# EAGLE design BreaV6 (EAGLE 8.4.3)

## Sheet 1 of 2
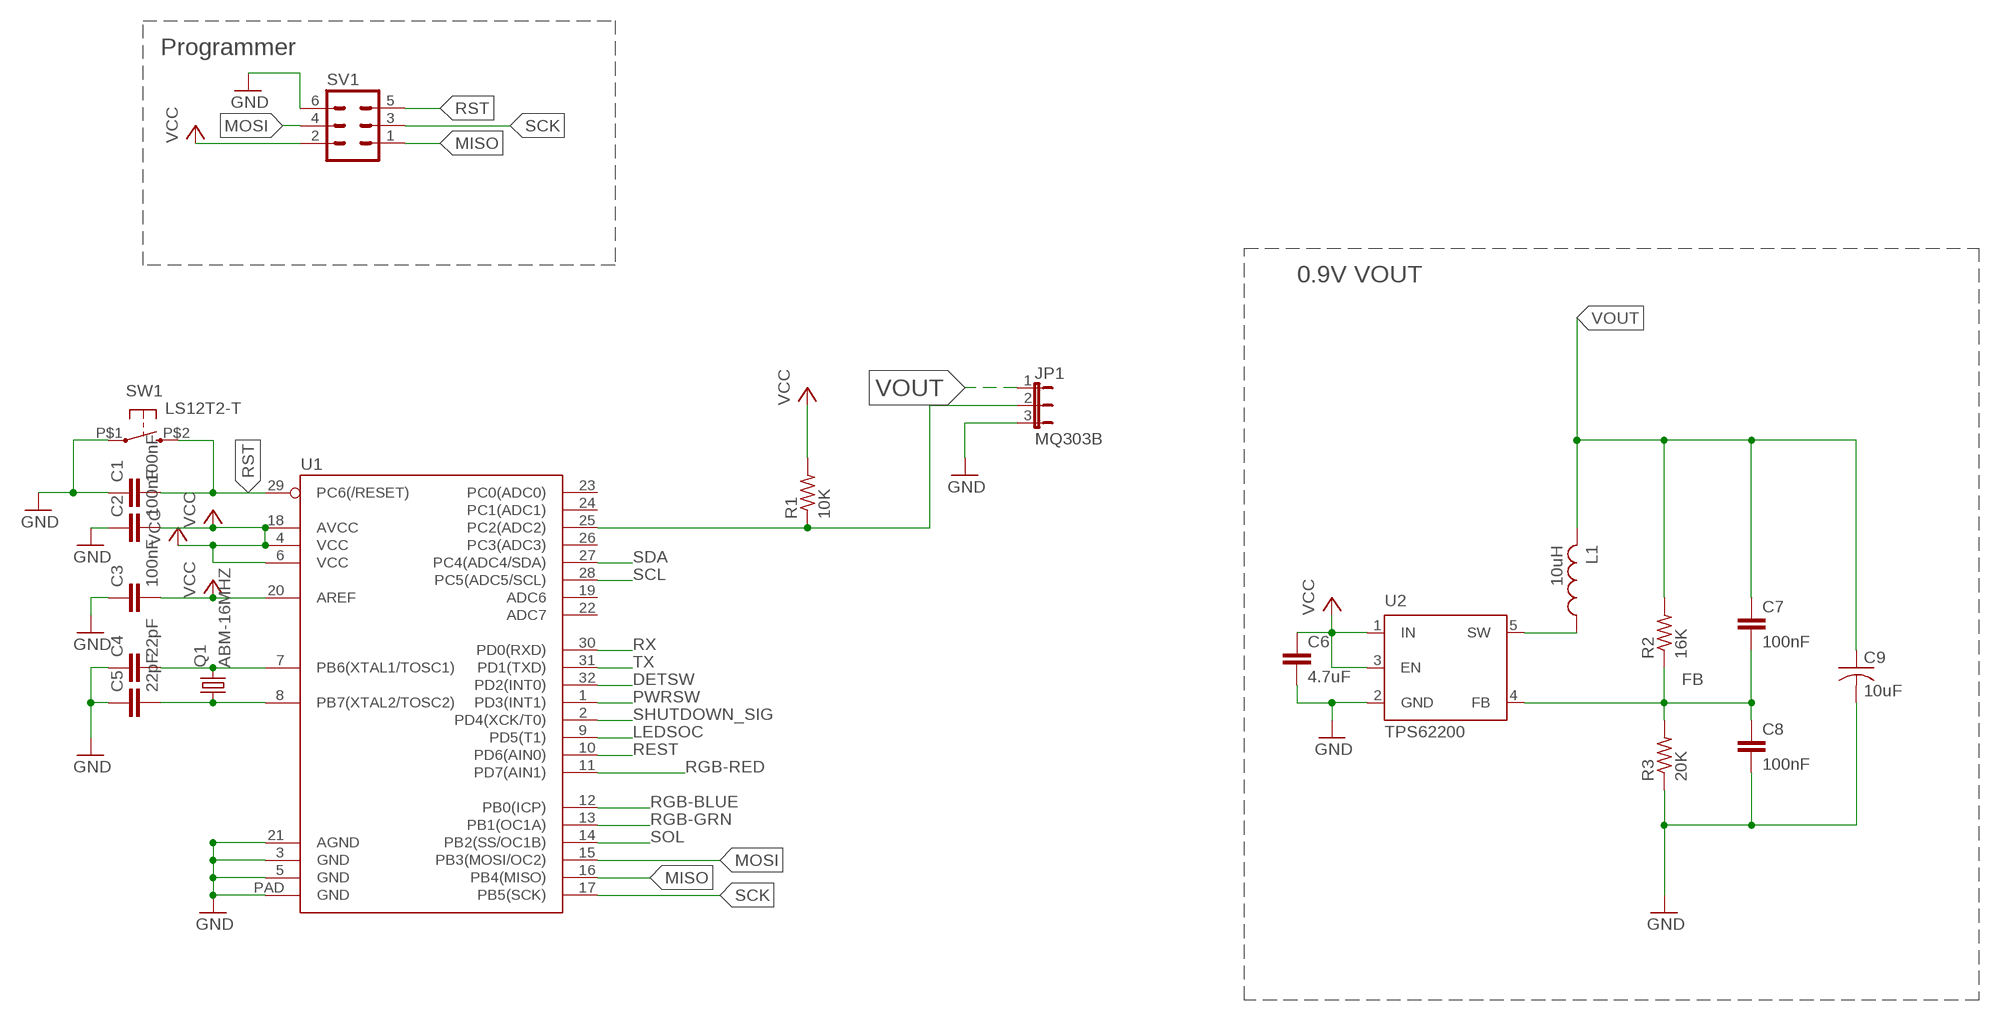
[diagram p0: schematic, sheet 1]

### Parts
C1  100nF  C-EUC0603  [C0603]
C2  100nF  C-EUC0603  [C0603]
C3  100nF  C-EUC0603  [C0603]
C4  22pF  C-EUC0603  [C0603]
C5  22pF  C-EUC0603  [C0603]
C6  4.7uF  C-EUC0402  [C0402]
C7  100nF  C-EUC0402  [C0402]
C8  100nF  C-EUC0402  [C0402]
C9  10uF  C-USC0805K  [C0805K]
JP1  MQ303B  JP2E  [JP2]
L1  10uH  L-USL2825P  [L2825P]
Q1  ABM-16MHZ  [ABM-16MHZ]
R1  10K  R-US_R0402  [R0402]
R2  16K  R-US_R0402  [R0402]
R3  20K  R-US_R0402  [R0402]
SV1  MA03-2  [MA03-2]
SW1  LS12T2-T  [LS12T2-T]
U1  ATMEGA328P_MLFMLF32  [MLF32-PAD]
U2  TPS62200  [TPS62200]

### Nets
DETSW: U1.32(PD2(INT0)) ; also sheet 2
FB: C7.2 C8.1 R2.1 R3.2 U2.4(FB)
GND: C1.1 C2.1 C3.1 C4.1 C5.1 C6.2 C8.2 C9.2 JP1.3 R3.1 SV1.6(MISO) SW1.P$1(S1) U1.3(GND) U1.5(GND) U1.21(AGND) U1.PAD(GND) U2.2(GND) ; also sheet 2
LEDSOC: U1.9(PD5(T1)) ; also sheet 2
MISO: SV1.1 U1.16(PB4(MISO))
MOSI: SV1.4 U1.15(PB3(MOSI/OC2))
N$1: C5.2 Q1.P$1 U1.8(PB7(XTAL2/TOSC2))
N$2: C4.2 Q1.P$2 U1.7(PB6(XTAL1/TOSC1))
N$3: JP1.2 R1.1 U1.25(PC2(ADC2))
PWRSW: U1.1(PD3(INT1)) ; also sheet 2
REST: U1.10(PD6(AIN0)) ; also sheet 2
RGB-BLUE: U1.12(PB0(ICP)) ; also sheet 2
RGB-GRN: U1.13(PB1(OC1A)) ; also sheet 2
RGB-RED: U1.11(PD7(AIN1)) ; also sheet 2
RST: C1.2 SV1.5(VTG) SW1.P$2(S2) U1.29(PC6(/RESET))
RX: U1.30(PD0(RXD)) ; also sheet 2
SCK: SV1.3 U1.17(PB5(SCK))
SCL: U1.28(PC5(ADC5/SCL)) ; also sheet 2
SDA: U1.27(PC4(ADC4/SDA)) ; also sheet 2
SHUTDOWN_SIG: U1.2(PD4(XCK/T0)) ; also sheet 2
SOL: U1.14(PB2(SS/OC1B)) ; also sheet 2
SW: L1.1 U2.5(SW)
TX: U1.31(PD1(TXD)) ; also sheet 2
VCC: C2.2 C3.2 C6.1 R1.2 SV1.2 U1.4(VCC) U1.6(VCC) U1.18(AVCC) U1.20(AREF) U2.1(IN) U2.3(EN) ; also sheet 2
VOUT: C7.1 C9.1 JP1.1 L1.2 R2.2
Unconnected: U1.19(ADC6) U1.22(ADC7) U1.23(PC0(ADC0)) U1.24(PC1(ADC1)) U1.26(PC3(ADC3))

### Notes on the sheet
- Programmer
- 0.9V VOUT

## Sheet 2 of 2
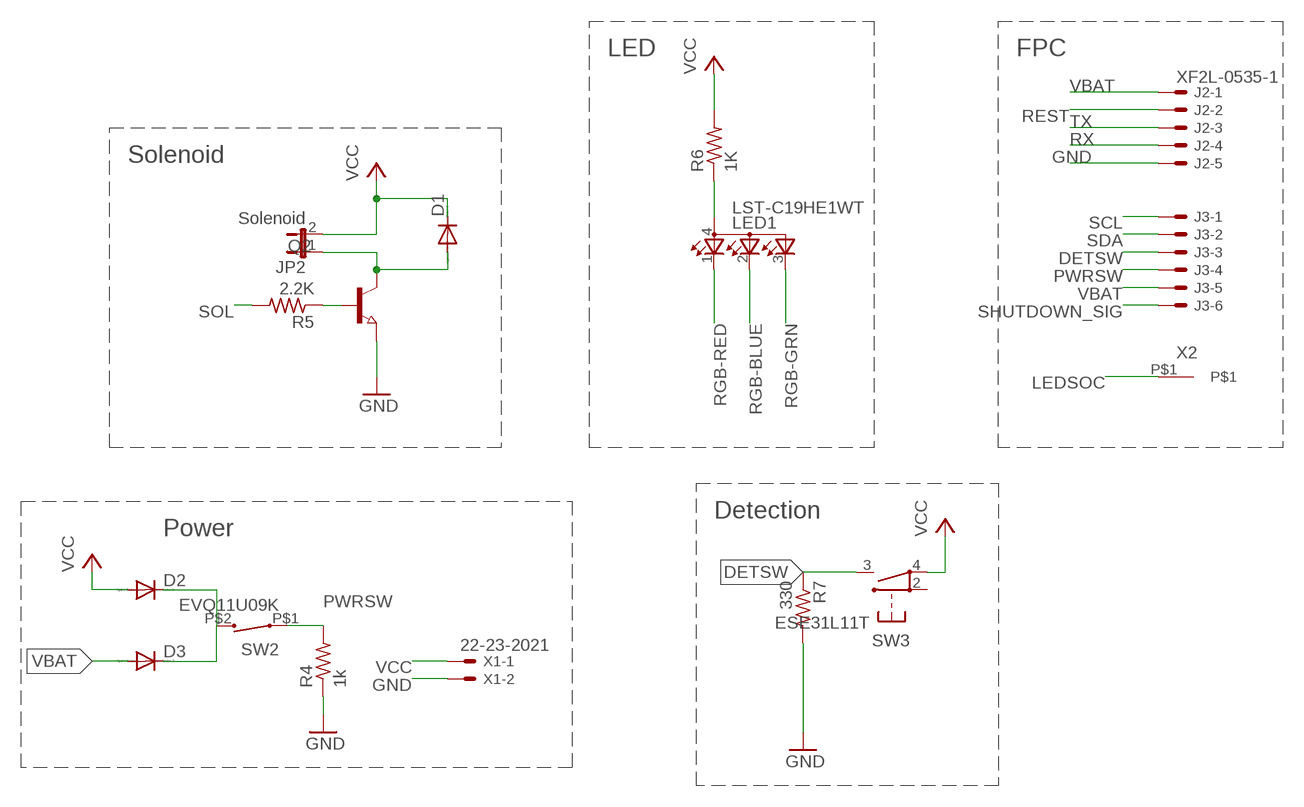
[diagram p1: schematic, sheet 2]

### Parts
D1  DIODE-SOD123  [SOD123]
D2  DIODE-SOD523  [SOD523]
D3  DIODE-SOD523  [SOD523]
J2  XF2L-0535-1  [XF2L-0535-1]
J3  XF2L-0635-1  [XF2L-0635-1]
JP2  Solenoid  JP1E  [JP1]
LED1  LST-C19HE1WT  [LST-C19HE1WT]
Q2  NPN-TRANSISTOR_SOT23  [SOT23]
R4  1k  R-US_R0402  [R0402]
R5  2.2K  R-US_R0402  [R0402]
R6  1K  R-US_R0402  [R0402]
R7  330  R-US_R0402  [R0402]
SW2  EVQ11U09K  [EVQ11U-09K]
SW3  ESE31L11T  [SWITCH]
X1  22-23-2021  [22-23-2021]
X2  CON-1PINB  [CON-1PIN-B]

### Nets
DETSW: J3.3 R7.1 SW3.3 ; also sheet 1
GND: J2.5 Q2.2(E) R4.1 R7.2 X1.2 ; also sheet 1
LEDSOC: X2.P$1 ; also sheet 1
N$4: D2.C D3.C SW2.P$2
N$5: LED1.4(A) R6.1
N$9: D1.A JP2.1 Q2.3(C)
N$10: Q2.1(B) R5.1
PWRSW: J3.4 R4.2 SW2.P$1 ; also sheet 1
REST: J2.2 ; also sheet 1
RGB-BLUE: LED1.2(CGREEN) ; also sheet 1
RGB-GRN: LED1.3(CBLUE) ; also sheet 1
RGB-RED: LED1.1(CRED) ; also sheet 1
RX: J2.4 ; also sheet 1
SCL: J3.1 ; also sheet 1
SDA: J3.2 ; also sheet 1
SHUTDOWN_SIG: J3.6 ; also sheet 1
SOL: R5.2 ; also sheet 1
TX: J2.3 ; also sheet 1
VBAT: D3.A J2.1 J3.5
VCC: D1.C D2.A JP2.2 R6.2 SW3.4(C3) X1.1 ; also sheet 1
Unconnected: SW3.2(C2)

### Notes on the sheet
- LED | FPC
- Solenoid
- Detection
- Power

## Library data of the parts
C1-C8 = rcl:C-EU: CAPACITOR, European symbol
C9 = resistor:C-US: CAPACITOR, American symbol
D1-D3 = diode:DIODE-: DIODE
J2 = adafruit:XF2*-05?: OMRON FPC Connector Source : http://www.omron.com/ecb/products/pdf/fpc.pdf
J3 = con-omron:XF2*-06?: OMRON FPC Connector Source : http://www.omron.com/ecb/products/pdf/fpc.pdf; MPN: XF2L-0635-1; OC_FARNELL: unknown; OC_NEWARK: 05M1986
JP1 = jumper:JP2E: JUMPER
JP2 = jumper:JP1E: JUMPER
L1 = resistor:L-US: INDUCTOR, American symbol
LED1 = led:LST-C19HE1WT
Q1 = NewPart:ABM-16MHZ: Crystal 16MHz 18pF
Q2 = semicon-smd-ipc:NPN-TRANSISTOR_: NPN TRANSISTOR
R1-R7 = resistor:R-US_: RESISTOR, American symbol
SV1 = con-lstb:MA03-2: PIN HEADER; OC_FARNELL: unknown; OC_NEWARK: unknown
SW1 = NewPart:LS12T2-T: Side Switch for hardware reset
SW2 = NewPart:EVQ11U09K
SW3 = NewPart:ESE31L11T: Panasonic Detector Switch
U1 = SparkFun-DigitalIC:ATMEGA328P_MLF: 32-Pin Atmega328 part Commonly used on Arduino compatible boards Available in QFP and QFN packages TQFP is IC-09069 QFN is non-stock
U2 = NewPart:TPS62200: TI TPS62200 Buck Converter
X1 = con-molex:22-23-2021: .100" (2.54mm) Center Header - 2 Pin; MF: MOLEX; MPN: 22-23-2021; OC_FARNELL: 1462926; OC_NEWARK: 25C3832
X2 = NewPart:CON-1PINB

## Board
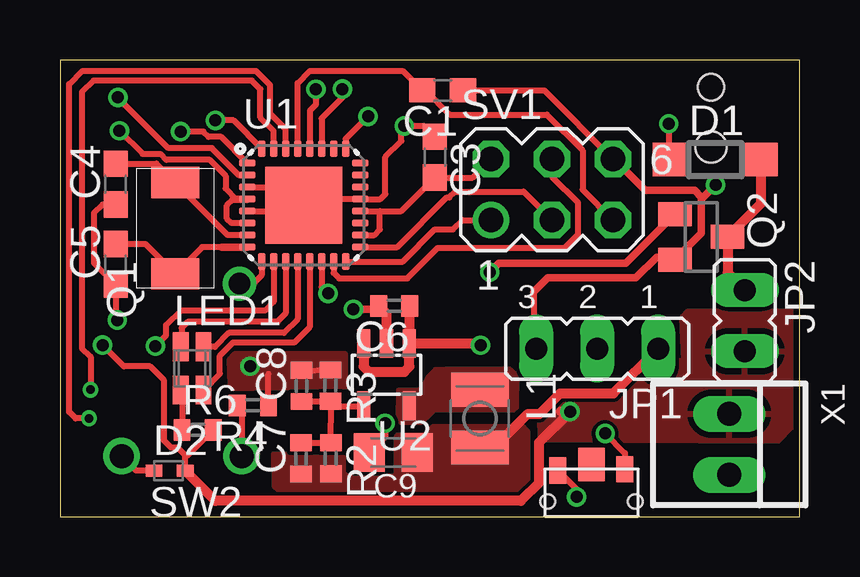
[diagram p2: board, top side]
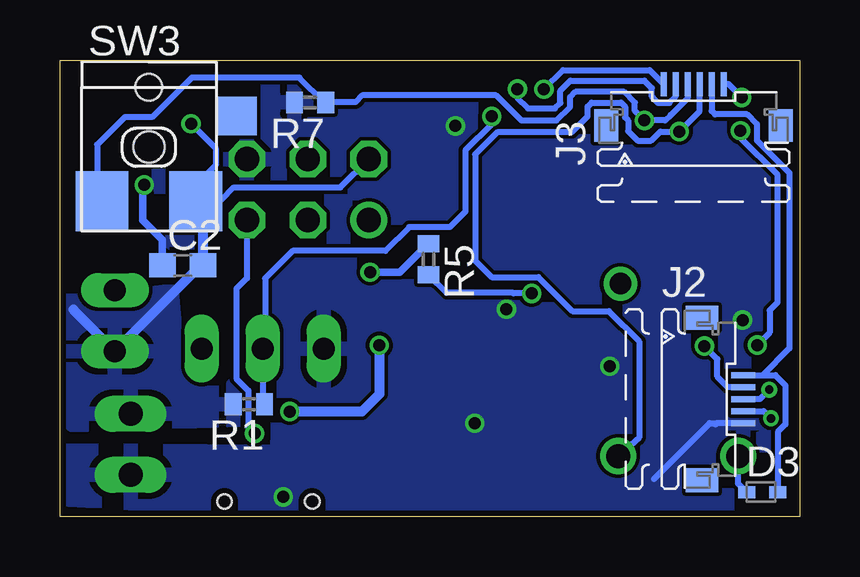
[diagram p3: board, bottom side, seen from below]

Size 30.83 x 19.04 mm. Coordinates in mm from the lower left corner, seen from the top.
Outline: 30.83,0 0,0 0,19.03 30.83,19.03
Outline: 30.83,0 30.83,0
Outline: 30.83,0 30.83,19.03
Outline: 30.83,19.03 30.83,19.04
Copper layers (1*16): Top 0.035mm / dielectric 1.5mm / Bottom 0.035mm
Design rules "SeeedStudio_2layer_DRU_no_angle_20140221": minimum track width 6mil, minimum drill 12mil, track to track 6mil, track to pad 6mil, pad to pad 6mil, via to via 6mil, smd to smd 0mil, copper to edge 10mil, drill to drill 10mil, minimum pad ring 10mil, minimum via ring 6mil, stop-mask expansion 2mil, vias tented up to drill 100mil, thermal gap 10mil

### Footprints (pad centres in the part's own frame; a part is rotated, then mirrored left to right if it is on the bottom)
C0603 = smd 1.1 x 1: 1 -0.85,0; 2 0.85,0
C0402 = smd 0.7 x 0.9: 1 -0.65,0; 2 0.65,0
C0805K = smd 1.3 x 1.6: 1 -1,0; 2 1,0
SOD123 = smd 1.4 x 1.4: A 1.9,0; C -1.9,0
SOD523 = smd 0.7 x 0.5: A 0.7,0; C -0.6,0
XF2L-0535-1 = smd 1 x 0.25: 1 1.905,1; 2 1.905,0.5; 3 1.905,0; 4 1.905,-0.5; 5 1.905,-1 | smd 1.34 x 1: M1 0.18,3.388; M2 0.18,-3.388
XF2L-0635-1 = smd 1 x 0.25: 1 1.905,1.25; 2 1.905,0.75; 3 1.905,0.25; 4 1.905,-0.25; 5 1.905,-0.75; 6 1.905,-1.25 | smd 1.34 x 1: M1 0.18,3.638; M2 0.18,-3.638
JP2 = drill 0.914 long: 1 -2.54,0; 2 0,0; 3 2.54,0
JP1 = drill 0.914 long: 1 0,-1.27; 2 0,1.27
L2825P = smd 1.4 x 2.4: 1 -1.2,0; 2 1.2,0
LST-C19HE1WT = smd 0.65 x 1.2: 1 -0.475,0.9; 2 0.475,0.9; 3 0.475,-0.9; 4 -0.475,-0.9
ABM-16MHZ = smd 1.3 x 2: P$1 0.6,-1.6; P$2 4.4,-1.6
SOT23 = smd 1 x 1.4: 1 -0.95,-1.1; 2 0.95,-1.1; 3 0,1.1
R0402 = smd 0.7 x 0.9: 1 -0.65,0; 2 0.65,0
MA03-2 = drill 1.016: 1 -2.54,-1.27 | drill 1.016 octagon: 2 -2.54,1.27; 3 0,-1.27; 4 0,1.27; 5 2.54,-1.27; 6 2.54,1.27
LS12T2-T = smd 1.1 x 0.7: P$1 0.05,-1.41; P$2 0,1.39 | smd 1.4 x 1.1: P$3 -0.2,0 | hole 0.6: 1.35,-1.825; 1.35,1.825
EVQ11U-09K = drill 1: P$1 -2.5,0; P$2 2.5,0
SWITCH = smd 1.7 x 1.6: 2 3.65,1.3 | smd 2.2 x 2.5: 3 -1.95,-2.25; 4 1.95,-2.25 | hole 1.1: 0,2.5 | hole 1.3: 0,0
MLF32-PAD = smd 0.7 x 0.3: 1 -2.35,1.75; 2 -2.35,1.25; 3 -2.35,0.75; 4 -2.35,0.25; 5 -2.35,-0.25; 6 -2.35,-0.75; 7 -2.35,-1.25; 8 -2.35,-1.75; 17 2.35,-1.75; 18 2.35,-1.25; 19 2.35,-0.75; 20 2.35,-0.25; 21 2.35,0.25; 22 2.35,0.75; 23 2.35,1.25; 24 2.35,1.75 | smd 0.3 x 0.7: 9 -1.75,-2.35; 10 -1.25,-2.35; 11 -0.75,-2.35; 12 -0.25,-2.35; 13 0.25,-2.35; 14 0.75,-2.35; 15 1.25,-2.35; 16 1.75,-2.35; 25 1.75,2.35; 26 1.25,2.35; 27 0.75,2.35; 28 0.25,2.35; 29 -0.25,2.35; 30 -0.75,2.35; 31 -1.25,2.35; 32 -1.75,2.35 | smd 3.2 x 3.2: PAD 0,0
TPS62200 = smd 0.55 x 1.2: 1 -0.95,-1.3; 2 0,-1.3; 3 0.95,-1.3; 4 0.95,1.3; 5 -0.95,1.3
22-23-2021 = drill 1 long: 1 -1.27,0; 2 1.27,0
CON-1PIN-B = drill 0.9: P$1 0,0

### Placement (x,y rotation side)
C1  15.94,17.77 180 top
C2  25.71,10.48 0 bottom
C3  15.61,14.99 270 top
C4  2.31,13.87 90 top
C5  2.31,10.53 90 top
C6  13.93,8.8 180 top
C7  10.04,2.44 90 top
C8  10.06,5.46 90 top
C9  13.88,2.69 180 top
D1  27.3,14.89 0 top
D2  4.52,1.93 0 top
D3  1.62,1.04 0 bottom
J2  4.26,4.91 0 bottom
J3  4.43,16.13 90 bottom
JP1  22.38,7.01 180 top
JP2  28.54,8.18 180 top
L1  17.5,4.1 270 top
LED1  5.51,6.19 0 top
Q1  3.21,9.53 90 top
Q2  26.72,11.67 270 top
R1  22.95,4.7 180 bottom
R2  11.28,2.45 270 top
R3  11.27,5.47 270 top
R4  8.04,4.65 180 top
R5  15.47,10.74 270 bottom
R6  5.74,3.63 0 top
R7  20.41,17.27 180 bottom
SV1  20.5,13.64 0 top
SW1  22.15,1.99 270 top
SW2  5.07,2.54 180 top
SW3  27.12,15.41 0 bottom
U1  10.16,12.99 0 top
U2  13.61,5.93 180 top
X1  27.88,3.03 270 top
X2  7.48,9.72 0 top

### Tracks (layer width: path | path; a pad name or v marks a point on that pad's centre or on a via)
DETSW  (via drill 0.5)
  Top 0.254: v6.48,16.52 7.23,16.52 U1.32
  Bottom 0.254: SW3.3 29.28,13.36 29.28,15.51 28.13,16.66 26.99,16.66 25.34,18.31 20.86,18.31 19.82,17.27 R7.1 19.74,17.29 18.51,17.29 18.23,17.57 12.65,17.57 11.61,16.52 10.13,16.52 9.58,17.07 9.58,17.49 9.36,17.71 7.32,17.71 6.88,17.26 6.88,16.92 v6.48,16.52 5.61,16.52 5.39,16.74 5.37,16.74 4.68,17.44 J3.3
FB
  Top 0.254: R3.2 10.97,4.68 | R3.2 11.04,4.61 12.64,4.61 U2.4 | C7.2 R2.1 11.29,4.74 R3.2 | C8.1 arc-90 10.08,4.83 R3.2
GND  (via drill 0.5)
  Top 0.254: U1.3 9.41,13.74 U1.PAD | U1.5 9.91,12.74 U1.PAD | U1.PAD 10.41,13.24 U1.21 13.35,13.24 13.56,13.45 13.56,15 14.22,15.66 14.22,16.17 v14.35,16.3 15.16,16.3 C3.1 | C1.1 20.18,17.77 SV1.6 | C9.2 12.78,2.83 | C9.2 12.64,3.09 | C4.1 1.76,13.02 1.42,12.67 1.42,10.58 C5.1 2.31,8.28 v2.39,8.2 | SW1.P$1 21.53,1.15 v21.53,0.83 | R3.1 10.07,6.04 C8.2 10.02,6.09 | v13.55,3.9 13.55,3.35 C9.2 | v7.91,6.27 v7.92,6.28 | 19.74,9.39 19.74,7.11 JP1.3 | R4.1 8.69,5.95
  Top 0.305: SV1.6 23.09,14.91 24.39,13.61 26.45,13.61 26.73,13.33 26.73,13.24 | v12.23,8.65 13.14,8.65 C6.2 | Q2.2 | 26.73,13.24 26.73,11.83 Q2.2 | 19.74,9.39 20.32,9.97 24,9.97 24.86,10.83 25.5,10.83 Q2.2 | 26.73,13.24 v27.32,13.83
  Top 0.406: C6.2 13.45,8.8 | 13.4,8.68 C6.2 | U2.2 13.61,8.47 C6.2
  Bottom 0.254: 3.46,3.91 3.51,3.86 | J2.5 3.46,3.91 | 6.09,1.58 3.76,3.91 3.46,3.91
  Bottom 0.305: C2.1 26.56,11.54 27.38,12.36 27.38,13.77 v27.32,13.83
  pour Top (no thermals): 7.29,6.79 11.87,6.79 11.87,5.37 8.89,5.37 7.27,5.35 7.12,5.5 7.08,6.57
  pour Bottom: 0.25,18.96 29.97,18.96 30.09,18.84 30.09,15.66 29.71,15.28 26.67,15.28 26.83,14.75 26.19,11.43 23.45,10.25 23.11,7.28 21.69,6.64 21.77,2.72 30.5,2.78 30.44,0.71 21.2,0.17 0.5,0.17 0.25,0.42
LEDSOC
  Top 0.254: U1.9 8.41,10.07 8.06,9.72 X2.P$1
MISO
  Top 0.254: U1.16 14.28,10.64 15.62,11.98 16.38,11.98 16.77,12.37 SV1.1
MOSI
  Top 0.254: U1.15 11.41,10.17 11.63,9.95 14.47,9.95 15.74,11.22 21.03,11.22 21.59,11.77 21.59,13.1 20.52,14.16 20.52,14.89 SV1.4
N$1
  Top 0.254: 6.74,11.24 5.92,11.24 Q1.P$1 3.56,11.38 C5.2
  Top 0.305: U1.8 6.74,11.24
N$2
  Top 0.254: U1.7 7,11.74 Q1.P$2 4.02,14.72 C4.2
N$3  (via drill 0.5)
  Top 0.254: U1.25 11.91,15.75 v12.84,16.69
  Bottom 0.254: R1.1 22.38,4.77 JP1.2 22.28,7.11 22.28,9.95 21.14,11.09 17.27,11.09 16.28,12.08 14.58,12.08 13.93,12.72 13.93,15.28 12.84,16.37 v12.84,16.69
N$4
  Top 0.254: D2.C 3.18,1.93 SW2.P$2
  Bottom 0.254: D3.C 2.57,1.39 SW2.P$2
N$5
  Top 0.254: LED1.4 5.09,5.24 R6.1
N$9
  Top 0.406: JP2.1 27.82,10.17 Q2.3 29.2,13.05 D1.A
N$10  (via drill 0.5)
  Top 0.305: v17.9,10.2 18.28,10.58 23.58,10.58 Q2.1
  Bottom 0.305: v17.9,10.2 16.66,10.2 R5.1
PWRSW  (via drill 0.5)
  Top 0.254: R4.2 arc-90 7.57,4.47 SW2.P$1 | U1.1 6.71,15.84 6.19,15.84 5.97,16.06 v5.03,16.06
  Bottom 0.254: SW2.P$1 6.7,3.31 6.7,7.32 7.96,8.58 9.48,8.58 10.89,9.99 12.84,9.99 13.53,10.68 13.53,15.11 12.59,16.05 9.49,16.05 8.84,16.69 8.84,17.1 8.68,17.26 7.45,17.26 7.28,17.1 7.28,16.65 7.16,16.52 7.16,16.08 6.76,15.68 6.19,15.68 5.81,16.06 v5.03,16.06 4.18,16.91 J3.4
REST  (via drill 0.5)
  Top 0.254: v3.98,7.12 4.43,7.57 4.43,8 5.03,8.6 8.55,8.6 8.91,8.96 U1.10
  Bottom 0.254: J2.2 3,5.41 3.44,5.85 3.44,6.58 v3.98,7.12
RGB-BLUE
  Top 0.254: LED1.2 6.46,7.09 7.04,7.67 9.33,7.67 9.91,8.24 U1.12
RGB-GRN
  Top 0.254: LED1.3 6.67,5.97 6.67,6.72 7.21,7.26 9.76,7.26 10.41,7.91 U1.13
RGB-RED
  Top 0.254: LED1.1 5.07,7.12 5.07,7.88 5.32,8.13 9.06,8.13 9.41,8.48 U1.11
RST  (via drill 0.5)
  Top 0.254: 15.04,17.82 C1.2 | C1.2 14.28,18.58 10.41,18.58 9.91,18.08 U1.29 | C1.2 15.24,17.77 16.25,16.76 20.29,16.76 21.78,15.27 21.78,13.63 SV1.5 | v22.72,3.48 23.54,2.66 SW1.P$2
  Bottom 0.254: SV1.5 23.04,9.94 23.48,9.51 23.48,5.76 22.98,5.26 22.98,3.74 v22.72,3.48
RX  (via drill 0.35)
  Top 0.254: U1.30 9.39,15.36 9.39,16.17 8.76,16.8 8.76,17.99 8.16,18.59 0.94,18.59 0.38,18.04 0.38,4.38 0.65,4.11 v1.21,4.11
  Bottom 0.254: J2.4 1.51,4.41 v1.21,4.11
SCK
  Top 0.254: U1.17 14.04,11.24 16.11,13.31 16.23,13.31 16.47,13.55 19.32,13.55 SV1.3
SCL  (via drill 0.5)
  Top 0.254: v10.66,17.82 10.66,17.18 10.41,16.93 U1.28
  Bottom 0.254: v10.66,17.82 9.86,18.62 6.26,18.62 J3.1
SDA  (via drill 0.5)
  Top 0.254: U1.27 10.91,16.61 11.77,17.47 v11.77,17.83
  Bottom 0.254: v11.77,17.83 11.77,17.47 11.32,17.02 10.21,17.02 9.98,17.24 9.98,17.76 9.56,18.18 6.48,18.18 6.17,17.87 6.17,17.52 6.09,17.44 6.09,17.43 5.92,17.26 5.44,17.26 5.18,17.52 J3.2
SHUTDOWN_SIG  (via drill 0.5)
  Top 0.254: U1.2 7.45,14.24 6.33,15.37 4.52,15.37 v2.42,17.47 v2.42,17.48
  Bottom 0.254: v2.42,17.48 2.97,18.04 J3.6
SOL  (via drill 0.5)
  Top 0.254: U1.14 10.91,9.58 v11.17,9.31
  Bottom 0.254: v11.17,9.31 11.92,9.31 11.95,9.33 14.72,9.33 R5.2
SW
  pour Top (no thermals): 14.19,5.27 14.12,5.26 14.1,4.05 14.25,3.94 15.03,3.96 15.32,4.22 15.59,4.48 15.95,4.49 18.86,4.46 19.02,4.6 19.03,5.88 18.75,6.13 16.45,6.15 15.65,6.12 15.34,5.79 15.07,5.28
TX  (via drill 0.35)
  Top 0.254: v1.27,5.3 1.27,6.68 0.92,7.04 0.92,17.71 1.39,18.18 7.99,18.18 8.35,17.82 8.35,16.64 8.91,16.08 U1.31
  Bottom 0.254: v1.27,5.3 1.67,4.91 J2.3
VBAT
  Bottom 0.254: J2.1 1.55,5.91 | 1.55,5.91 0.44,7.02 0.44,14.33 1.79,15.69 1.79,16.37 2.19,16.77 3.53,16.77 3.68,16.92 J3.5 | D3.A 0.92,3.54 0.6,3.86 0.6,5.49 1.02,5.91 1.55,5.91
VCC  (via drill 0.5)
  Top 0.254: U1.20 13.34,12.74 | U1.18 13.1,11.74 13.33,11.98 13.33,12.74 13.34,12.74 | U1.6 7.15,12.24 6.96,12.43 6.96,12.99 7.21,13.24 | 13.34,12.74 14.21,12.74 C3.2 17.2,14.14 SV1.2 | v25.37,16.38 25.37,14.93 D1.C | 6.28,3.63 R6.2 5.32,2.56 5.22,2.56 | v1.78,7.16 2.66,6.28 3.76,6.28 4.32,5.72 4.32,3.21 4.62,2.9 4.88,2.9 5.22,2.56 | U1.4 7.35,13.24 6.91,13.69 6.91,14.22 6.24,14.88 4.44,14.88 4.19,15.12 3.44,15.12 v2.48,16.09 | D2.A 5.22,2.56
  Top 0.305: U1.4 7.21,13.24
  Top 0.406: 14.64,8.74 C6.1 14.56,8.77 U2.1 | 20.87,4.39 v21.25,4.39 19.97,3.11 19.97,1.43 19.21,0.67 6.48,0.67 D2.A | U2.3 12.66,6.26 12.87,6.05 14.35,6.05 14.56,6.26 U2.1 | U2.1 17.44,7.23 v17.52,7.15
  Bottom 0.254: SV1.2 19.14,13.73 23.58,13.73 24.12,13.2 25.13,13.2 SW3.4 | v25.37,16.38 24.33,15.34 24.33,14.68 25.17,13.83 | v1.78,7.16 1.26,7.68 1.26,8.61 0.93,8.94 0.93,14.25 2.48,15.8 v2.48,16.09
  Bottom 0.406: 25.17,13.83 SW3.4 24.86,12.84 24.86,10.59 | 30.27,8.64 JP2.2 24.86,10.59 | C2.2 24.86,10.59 | 21.07,4.39 v21.25,4.39 18.25,4.39 17.52,5.11 v17.52,7.15
  pour Bottom: 22.98,6.13 25.93,6.49 26.17,9.42 29.14,9.06 30.47,9.21 30.44,5.75 30.52,5.74 30.41,3.96 30.29,3.83 23.22,4.06 23.01,4.43 22.98,3.75
  pour Top: 26.17,8.57 30.46,8.57 30.46,3.72 29.9,3.16 20.03,3.21 19.99,5.27 23.46,5.3 24.64,6.48 26.02,6.52 25.94,8.33
VOUT
  Top 0.406: 17.46,2.65 L1.2 18.08,2.88 19.5,4.3 19.99,4.3 20.84,5.15 23.06,5.15 JP1.1
  pour Top (no thermals): 8.93,2.62 11.63,2.61 11.78,2.48 11.77,1.87 11.91,1.7 13.86,1.69 14.03,1.75 14.03,3.36 14.09,3.41 15.3,3.43 15.55,3.76 15.82,3.76 19.29,3.75 19.48,3.54 19.5,1.2 19.12,0.92 9.4,0.89 8.95,1.29